# Altium schematic sheet GPS.SchDoc
size A4; SheetNumber: 6; SheetTotal: 7
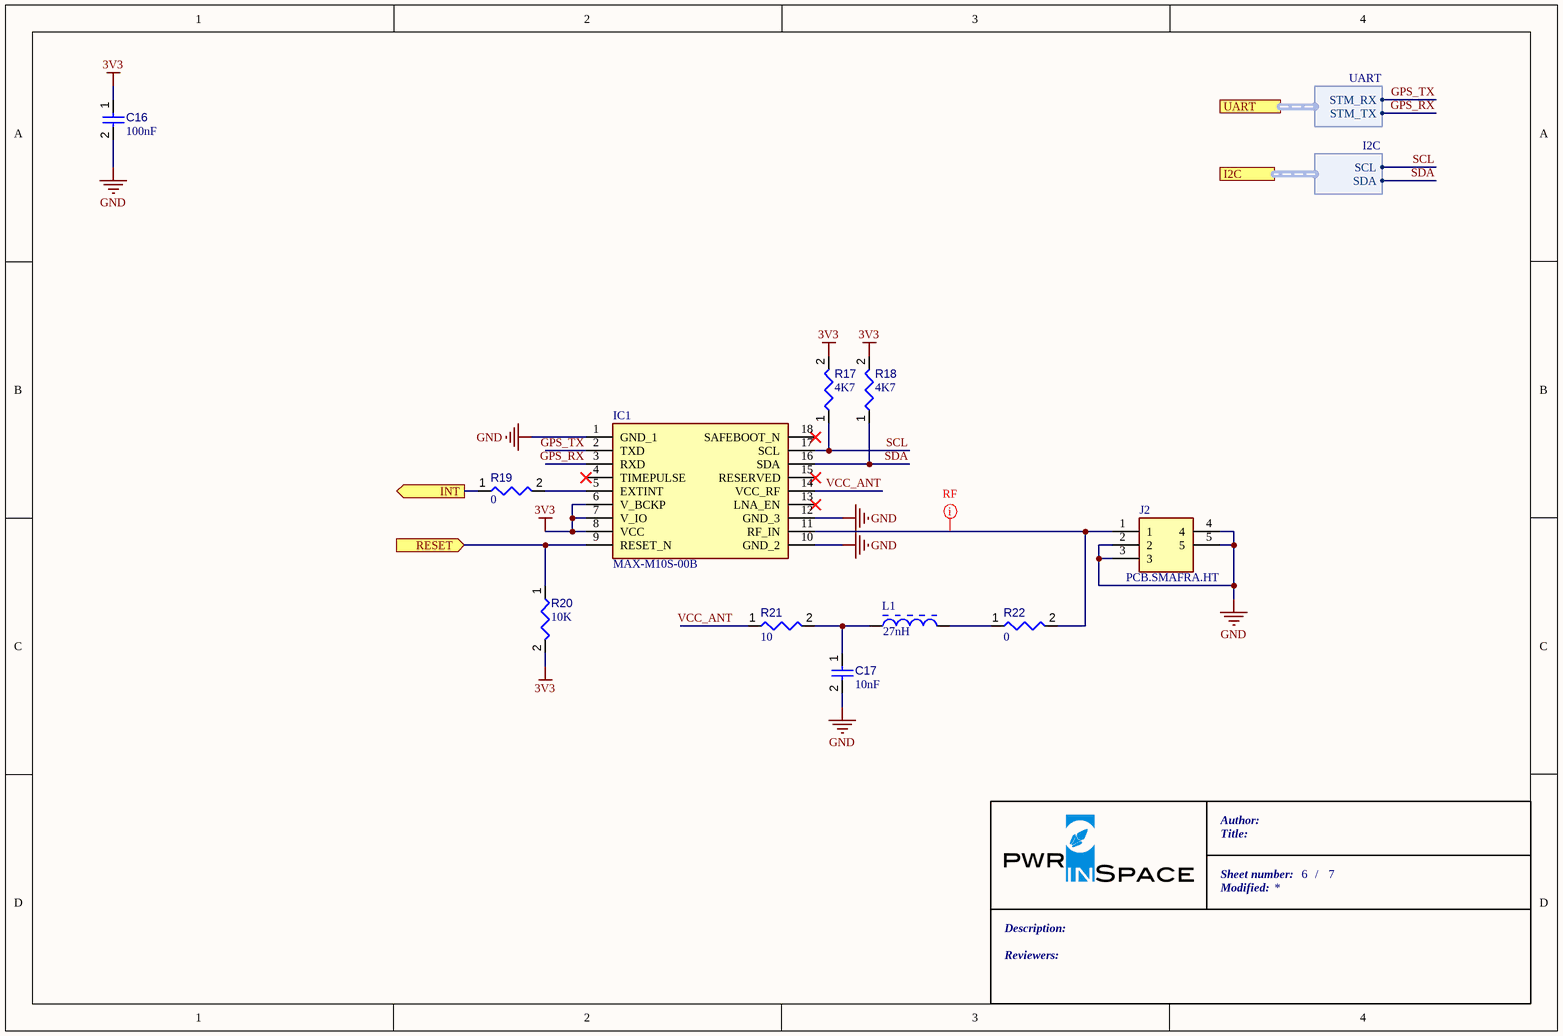
[diagram p0: GPS.SchDoc]

## Parts
C16  value 100nF  [CAPC0805(2012)145_L]  (hidden comment: Capacitor 100µF +/-20% 6.3V 0805)
C17  value 10nF  [CAPC0805(2012)145_L]  (hidden comment: Capacitor 100µF +/-20% 6.3V 0805)
IC1  MAX-M10S-00B  [MAXM10S00B]
J2  PCB.SMAFRA.HT  [PCBSMAFRAHT]
L1  27nH  [INDC2013X105X50ML20T20]
R17  value 4K7  [RESC0805(2012)_L]  (hidden comment: Resistor 4R7  +/-5 % 0805 125 mW)
R18  value 4K7  [RESC0805(2012)_L]  (hidden comment: Resistor 4R7  +/-5 % 0805 125 mW)
R19  value 0  [RESC0805(2012)_L]  (hidden comment: Resistor 4R7  +/-5 % 0805 125 mW)
R20  value 10K  [RESC0805(2012)_L]  (hidden comment: Resistor 4R7  +/-5 % 0805 125 mW)
R21  value 10  [RESC0805(2012)_L]  (hidden comment: Resistor 4R7  +/-5 % 0805 125 mW)
R22  value 0  [RESC0805(2012)_L]  (hidden comment: Resistor 4R7  +/-5 % 0805 125 mW)

## Ports
I2C (harness I2C), INT (out), RESET (in), UART (harness UART)

## Harnesses
UART: STM_RX, STM_TX
I2C: SCL, SDA

## Nets
3V3: C16.1 IC1.6(V_BCKP) IC1.7(V_IO) IC1.8(VCC) R17.2 R18.2 R20.2
GND: C16.2 C17.2 IC1.1(GND_1) IC1.10(GND_2) IC1.12(GND_3) J2.2 J2.3 J2.4 J2.5
GPS_RX: IC1.3(RXD) ; port UART.STM_TX
GPS_TX: IC1.2(TXD) ; port UART.STM_RX
INT: R19.1 ; port INT
RESET: IC1.9(RESET_N) R20.1 ; port RESET
SCL: IC1.17(SCL) R17.1 ; port I2C.SCL
SDA: IC1.16(SDA) R18.1 ; port I2C.SDA
VCC_ANT: IC1.14(VCC_RF) R21.1
NetC17_1: C17.1 L1.1 R21.2
NetIC1_5: IC1.5(EXTINT) R19.2
NetIC1_11: IC1.11(RF_IN) J2.1 R22.2
NetL1_2: L1.2 R22.1

Not connected (* = marked no-connect by the designer): IC1 4(TIMEPULSE)* 13(LNA_EN)* 15(RESERVED)* 18(SAFEBOOT_N)*

## Layout directives
mark named RF: NetIC1_11

## Notes on the sheet
- Author:
- Title:
- Sheet number:
- Modified:
- /
- Reviewers:
- Description:

## Library data of the parts
C16 C17 = CMP-001-00054-4: Chip Capacitor, 100µF +/-20%, 6.3V, 0805, Thickness 1.45 mm; Tolerance: 10%; Min Operating Temperature: -55°C; Max Operating Temperature: 85°C; Pins: 2; Mounting Technology: SMT; Case/Package: 0805; Voltage Rating: 6.3V
IC1 = CMP-003-000008-1: Integrated Circuit; Manufacturer_Name: U-Blox; Height: 2.7mm; Source: SamacSys.SchLib; Datasheet Link: https://content.u-blox.com/sites/default/files/MAX-M10S_IntegrationManual_UBX-20053088.pdf; Design Item ID: MAX-M10S-00B; Manufacturer_Part_Number: MAX-M10S-00B; Mouser Price/Stock: https://www.mouser.co.uk/ProductDetail/u-blox/MAX-M10S-00B?qs=A6eO%252BMLsxmT0PfQYPb7LLQ%3D%3D; Mouser Part Number: 377-MAX-M10S-00B
J2 = CMP-002-000386-1: Connector; Manufacturer_Name: Taoglas; Height: 9mm; Mouser Price/Stock: https://www.mouser.co.uk/ProductDetail/Taoglas/PCB.SMAFRA.HT?qs=RuW%2Fu%252BNMQmubIFYcN8w5Dw%3D%3D; Design Item ID: PCB.SMAFRA.HT; Mouser Part Number: 960-PCB.SMAFRA.HT; Manufacturer_Part_Number: PCB.SMAFRA.HT; Source: SamacSys.SchLib; Datasheet Link: https://www.mouser.com/datasheet/2/398/PCB.SMAFRA.HT_-1220750.pdf
L1 = CMP-006-00000-3: IND, Chip Ferrite Bead, 330 Ohm, +/- 25%, 1.5 A, -55 to 125 degC, 0805 (2012 Metric), Tape and Reel; Manufacturer: Murata; Current Rating: 1.5A; Impedance: 330Ohm; Resistance: 90mohm; Max Operating Temperature: 125°C; Core Material: Ferrite; Case/Package: 0805; Mounting Technology: SM; Datasheet URL: http://psearch.en.murata.com/inductor/product/LQG15HS15NJ02_.pdf; Packaging: TapeandReel; Min Operating Temperature: -55°C; RoHS Compliant: True; Max Current Rating: 1.5A; Datasheet Version: Nov-11; Package Quantity: 4000; Package Reference: 0805; Package Description: 2-Pin Surface Mount Device, Body 2 x1.25 mm; Tolerance: 25%
R17-R22 = CMP-009-00174-3: Chip Resistor, 4,7 Ohms, +/-5 %, 125 mW, -55 to 155 degC, 0805; Tolerance: 5%; Power: 125mW; Max Operating Temperature: 155°C; Case/Package: 0805; Min Operating Temperature: -55°C; Pins: 2